# EAGLE design ElectroChemCC_PWM (EAGLE 7.2.0)
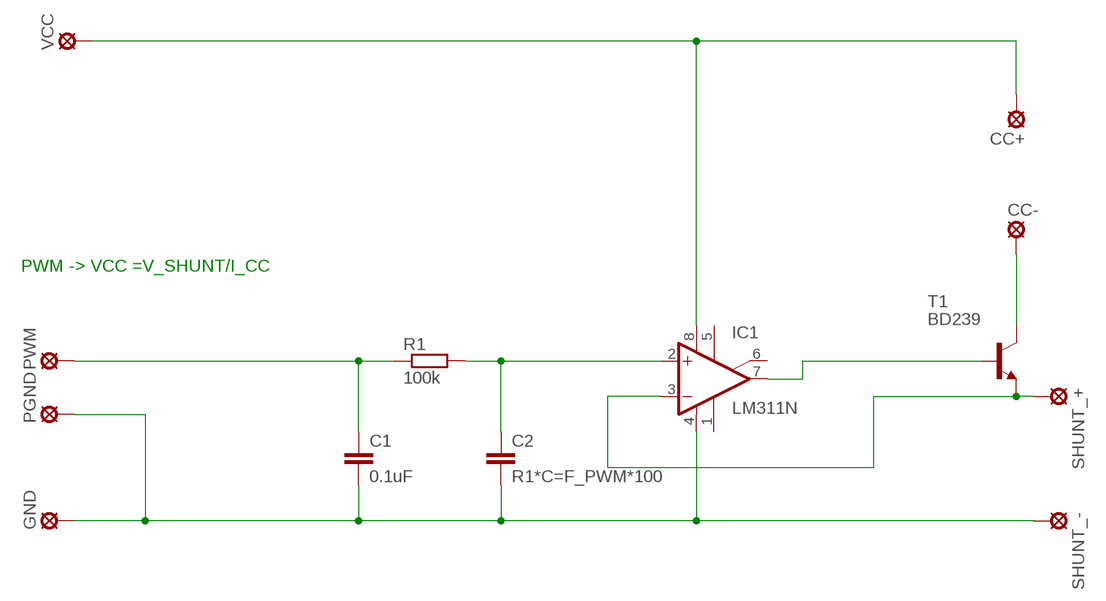
[diagram p0: schematic, sheet 1]

## Parts
C1  0.1uF  C-EU050-025X075  [C050-025X075]
C2  R1*C=F_PWM*100  C-EU050-025X075  [C050-025X075]
CC+  LSP10  [LSP10]
CC-  LSP10  [LSP10]
GND  LSP10  [LSP10]
IC1  LM311N  [DIL08]
PGND  LSP10  [LSP10]
PWM  LSP10  [LSP10]
R1  100k  R-EU_0207/10  [0207/10]
SHUNT_+  LSP10  [LSP10]
SHUNT_-  LSP10  [LSP10]
T1  BD239  [TO220]
VCC  LSP10  [LSP10]

## Nets
N$1: CC+.MP IC1.8(V+) VCC.MP
N$2: C1.2 C2.2 GND.MP IC1.4(V-) PGND.MP SHUNT_-.MP
N$3: C1.1 PWM.MP R1.1
N$4: C2.1 IC1.2(+IN) R1.2
N$5: IC1.7(OUT) T1.1(B)
N$6: CC-.MP T1.2(C)
N$7: IC1.3(-IN) SHUNT_+.MP T1.3(E)
Unconnected: IC1.1(GND) IC1.5(ON) IC1.6(ON/STR)

## Notes on the sheet
- PWM -> VCC =V_SHUNT/I_CC

## Library data of the parts
C1 C2 = rcl:C-EU: CAPACITOR, European symbol
CC+ CC- GND PGND PWM SHUNT_+ SHUNT_- VCC = solpad:LSP10: SOLDER PAD drill 1.0 mm, distributor Buerklin, 12H555
IC1 = linear:LM311: COMPARATOR
R1 = resistor:R-EU_: RESISTOR, European symbol
T1 = transistor-npn:BD239*: NPN Transistor

## Board
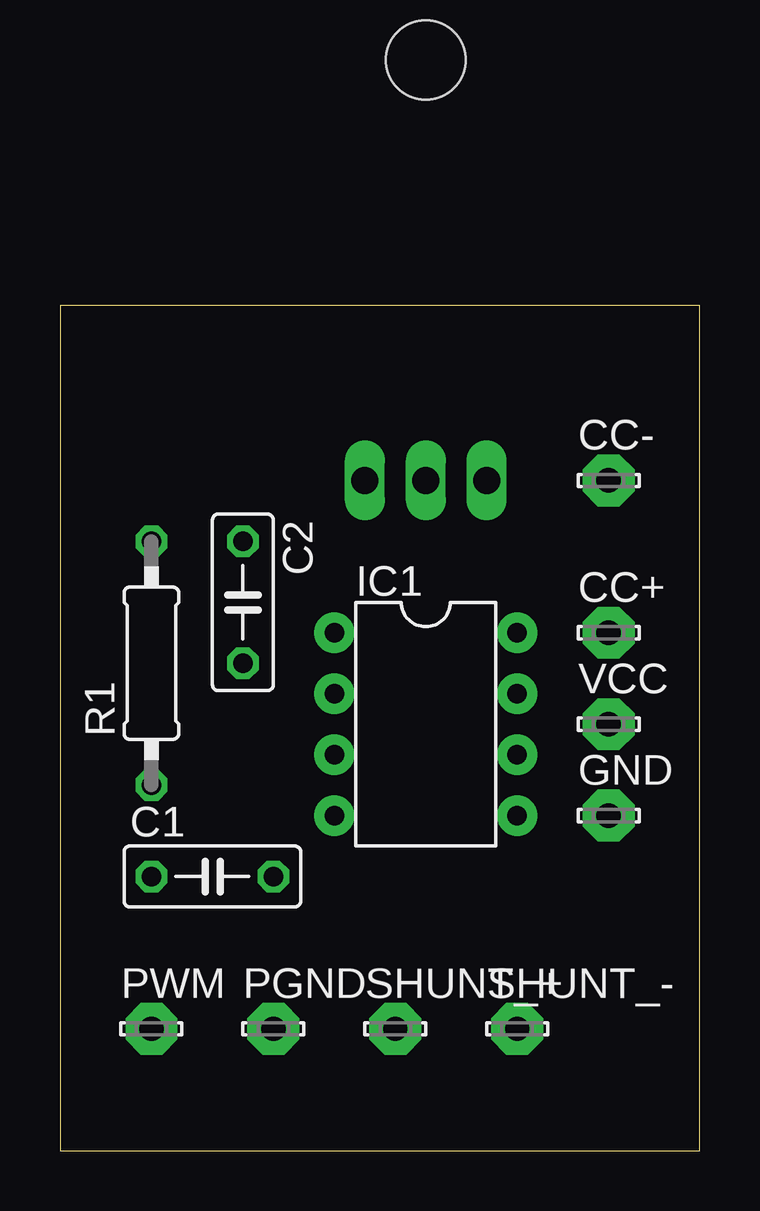
[diagram p1: board, top side]
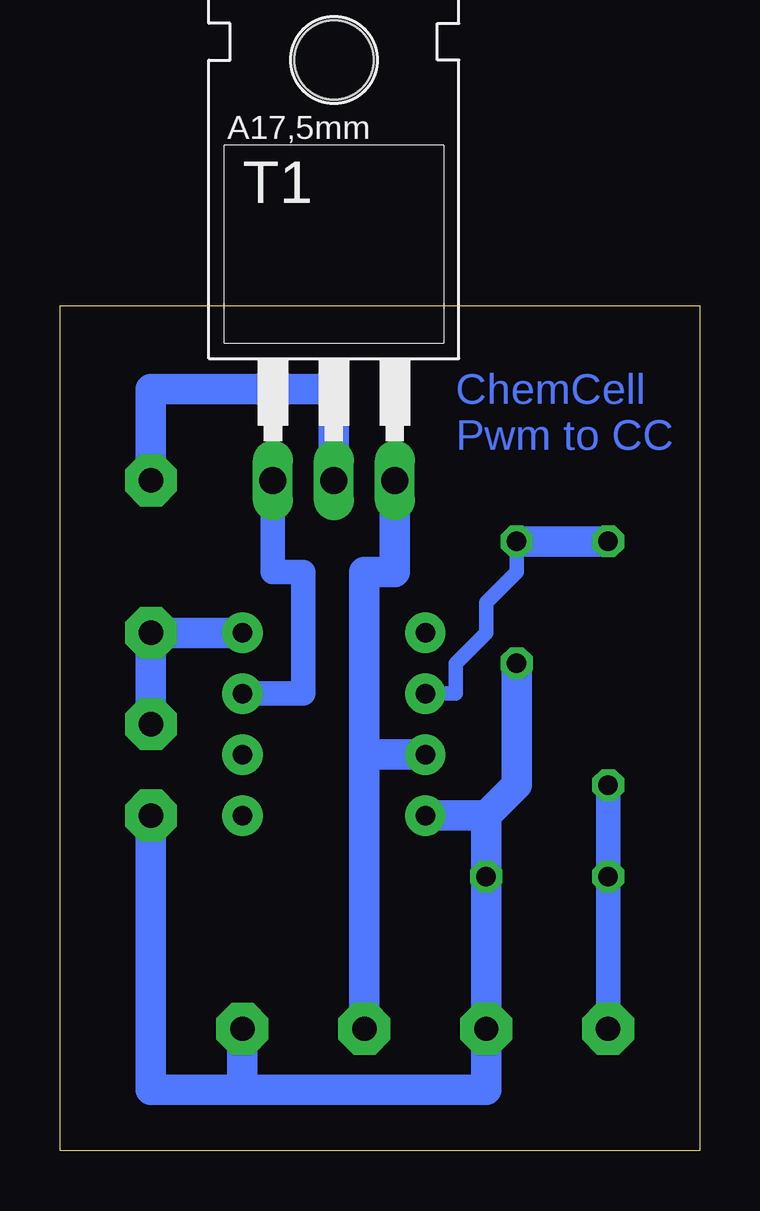
[diagram p2: board, bottom side, seen from below]

Size 26.65 x 35.23 mm. Coordinates in mm from the lower left corner, seen from the top.
Outline: 0,0 26.65,0 26.65,35.23 0,35.23 0,0
Copper layers (1*16): Top 0.035mm / dielectric 1.5mm / Bottom 0.035mm
Design rules "default": minimum track width 10mil, minimum drill 24mil, track to track 8mil, track to pad 8mil, pad to pad 8mil, via to via 8mil, smd to smd 8mil, copper to edge 40mil, drill to drill 8mil, minimum pad ring 10mil, minimum via ring 8mil, stop-mask expansion 4mil, vias tented up to drill 0mil, thermal gap 10mil

### Footprints (pad centres in the part's own frame; a part is rotated, then mirrored left to right if it is on the bottom)
C050-025X075 = drill 0.813 octagon: 1 -2.54,0; 2 2.54,0
LSP10 = drill 1.016 pad 2.159 octagon: MP 0,0
DIL08 = drill 0.813 pad 1.676: 1 -3.81,-3.81; 2 -1.27,-3.81; 3 1.27,-3.81; 4 3.81,-3.81; 5 3.81,3.81; 6 1.27,3.81; 7 -1.27,3.81; 8 -3.81,3.81
0207/10 = drill 0.813 octagon: 1 -5.08,0; 2 5.08,0
TO220 = drill 1.118 long: 1 -2.54,-6.35; 2 0,-6.35; 3 2.54,-6.35 | hole 3.302: 0,11.176

### Placement (x,y rotation side)
C1  6.35,11.43 0 top
C2  7.62,22.86 270 top
CC+  22.86,21.59 0 top
CC-  22.86,27.94 0 top
GND  22.86,13.97 0 top
IC1  15.24,17.78 270 top
PGND  8.89,5.08 0 top
PWM  3.81,5.08 0 top
R1  3.81,20.32 90 top
SHUNT_+  13.97,5.08 0 top
SHUNT_-  19.05,5.08 0 top
T1  15.24,34.29 0 bottom
VCC  22.86,17.78 0 top

### Tracks (layer width: path | path; a pad name or v marks a point on that pad's centre or on a via)
N$1
  Bottom 1.27: IC1.8 CC+.MP VCC.MP
N$2
  Bottom 1.27: GND.MP 22.86,2.54 19.05,2.54 | 19.05,2.54 8.89,2.54 PGND.MP C1.2 8.89,13.97 | SHUNT_-.MP 19.05,2.54 | C2.2 7.62,15.24 8.89,13.97 | IC1.4 8.89,13.97
N$3
  Bottom 1.016: R1.1 C1.1 PWM.MP
N$4
  Bottom 0.61: IC1.2 10.16,19.05 10.16,20.32 8.89,21.59 8.89,22.86 7.62,24.13 C2.1
  Bottom 1.27: R1.2 C2.1
N$5
  Bottom 1.016: IC1.7 16.51,19.05 16.51,24.13 17.78,24.13 T1.1
N$6
  Bottom 1.27: T1.2 15.24,31.75 22.86,31.75 CC-.MP
N$7
  Bottom 1.27: T1.3 12.7,24.13 13.97,24.13 13.97,16.51 | SHUNT_+.MP 13.97,16.51 | IC1.3 13.97,16.51

### Text on the board
Bottom: ChemCell / Pwm to CC